# Altium schematic sheet 04 Custom.SchDoc
size A3; SheetNumber: 3; SheetTotal: 15; SPICEModelCacheQCWDKNHH: <root> / <DocumentId>QCWDKNHH</DocumentId> / <CacheFrame Number="0"> / <Model Name="pnp" Kind="MDL"> / <Text>*Default PNP BJT / *PNP Trans Pinout: C,B,E / .MODEL PNP PNP()</Text> / </Model> / </CacheFrame> / </root>
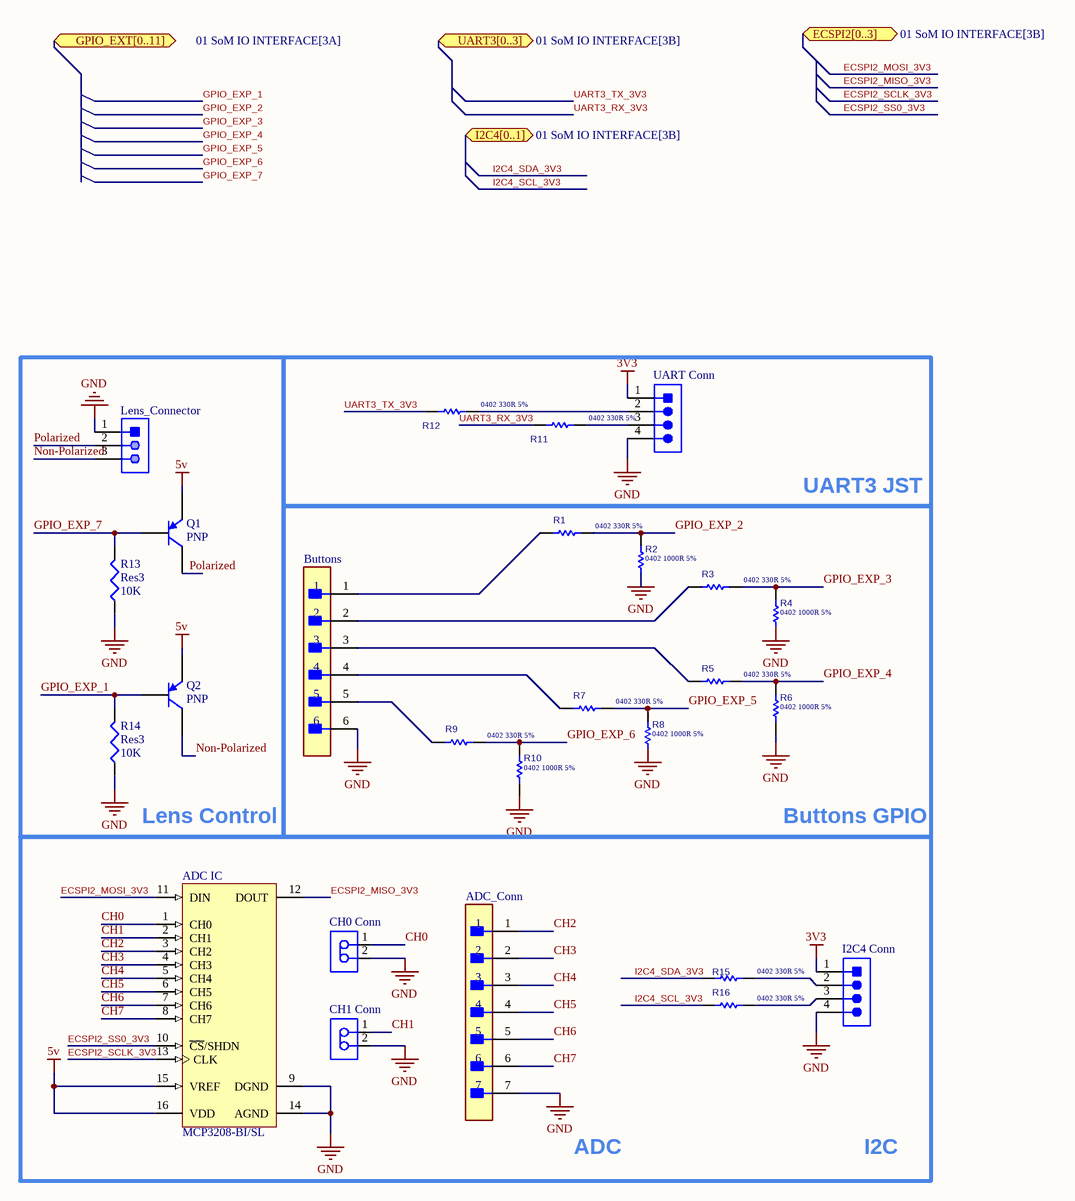
[diagram p0: 04 Custom.SchDoc]

## Parts
ADC_Conn  S7B-PH-K-S(LF)(SN)  [FP-S7B-PH-K-S_LF_SN-MFG]  (value not drawn)
ADC_IC  MCP3208-BI/SL  [SOIC-SL16_L]
Buttons  S6B-ZR(LF)(SN)  [FP-S6B-ZR_LF_SN-MFG]  (value not drawn)
CH0_Conn  B2B-PH-K-S(LF)(SN)  [JST-B2B-PH-K-S_V]  (value not drawn)
CH1_Conn  B2B-PH-K-S(LF)(SN)  [JST-B2B-PH-K-S_V]  (value not drawn)
I2C4_Conn  B4B-PH-K-S(LF)(SN)  [JST-B4B-PH-K-S_V]  (value not drawn)
Lens_Connector  B3B-PH-K-S(LF)(SN)  [JST-B3B-PH-K-S-3_V]  (value not drawn)
Q1  PNP  [SOT-23B_N]
Q2  PNP  [SOT-23B_N]
R1  0402 330R 5%  [0402_RES]
R2  0402 1000R 5%  [0402_RES]
R3  0402 330R 5%  [0402_RES]
R4  0402 1000R 5%  [0402_RES]
R5  0402 330R 5%  [0402_RES]
R6  0402 1000R 5%  [0402_RES]
R7  0402 330R 5%  [0402_RES]
R8  0402 1000R 5%  [0402_RES]
R9  0402 330R 5%  [0402_RES]
R10  0402 1000R 5%  [0402_RES]
R11  0402 330R 5%  [0402_RES]
R12  0402 330R 5%  [0402_RES]
R13  Res3  value 10K  [J1-0603]
R14  Res3  value 10K  [J1-0603]
R15  0402 330R 5%  [0402_RES]
R16  0402 330R 5%  [0402_RES]
UART_Conn  B4B-PH-K-S(LF)(SN)  [JST-B4B-PH-K-S_V]  (value not drawn)

## Blocks framed on the sheet
Lens Control: Lens_Connector Q1 Q2 R13 R14
UART3 JST: R11 R12 UART_Conn
Buttons GPIO: Buttons R1-R10

## Ports
ECSPI2[0..3] (bidir, see 01 SoM IO INTERFACE[3B]), GPIO_EXT[0..11] (bidir, see 01 SoM IO INTERFACE[3A]), I2C4[0..1] (bidir, see 01 SoM IO INTERFACE[3B]), UART3[0..3] (bidir, see 01 SoM IO INTERFACE[3B])

## Nets
3V3: I2C4_Conn.1 UART_Conn.1
5v: ADC_IC.15(VREF) ADC_IC.16(VDD) Q1.3(E) Q2.3(E)
GND: ADC_Conn.7 ADC_IC.9(DGND) ADC_IC.14(AGND) Buttons.6 CH0_Conn.2 CH1_Conn.2 I2C4_Conn.4 Lens_Connector.1 R2.1 R6.1 R10.1 R13.1 R14.1 UART_Conn.4
CH0: ADC_IC.1(CH0) CH0_Conn.1
CH1: ADC_IC.2(CH1) CH1_Conn.1
CH2: ADC_Conn.1 ADC_IC.3(CH2)
CH3: ADC_Conn.2 ADC_IC.4(CH3)
CH4: ADC_Conn.3 ADC_IC.5(CH4)
CH5: ADC_Conn.4 ADC_IC.6(CH5)
CH6: ADC_Conn.5 ADC_IC.7(CH6)
CH7: ADC_Conn.6 ADC_IC.8(CH7)
ECSPI2_MISO_3V3: ADC_IC.12(DOUT)
ECSPI2_MOSI_3V3: ADC_IC.11(DIN)
ECSPI2_SCLK_3V3: ADC_IC.13(CLK)
ECSPI2_SS0_3V3: ADC_IC.10(~{CS}/SHDN)
GPIO_EXP_1: Q2.2(B) R14.2
GPIO_EXP_2: R1.2 R2.2
GPIO_EXP_3: R3.2 R4.2
GPIO_EXP_4: R5.2 R6.2
GPIO_EXP_5: R7.2 R8.2
GPIO_EXP_6: R9.2 R10.2
GPIO_EXP_7: Q1.2(B) R13.2
I2C4_SCL_3V3: R16.1
I2C4_SDA_3V3: R15.1
Non-Polarized: Lens_Connector.3 Q2.1(C)
Polarized: Lens_Connector.2 Q1.1(C)
UART3_RX_3V3: R11.1
UART3_TX_3V3: R12.1
NetButtons_1: Buttons.1 R1.1
NetButtons_2: Buttons.2 R3.1
NetButtons_3: Buttons.3 R5.1
NetButtons_4: Buttons.4 R7.1
NetButtons_5: Buttons.5 R9.1
NetI2C4_Conn_2: I2C4_Conn.2 R15.2
NetI2C4_Conn_3: I2C4_Conn.3 R16.2
NetR11_2: R11.2 UART_Conn.3
NetR12_2: R12.2 UART_Conn.2

Not connected (* = marked no-connect by the designer): R4 1; R8 1

## Notes on the sheet
- ADC
- I2C
- Labels drawn without touching a wire or pin: GND

## Library data of the parts
ADC_Conn = CMP-17439-000222-1: CONN HEADER R/A 7POS 2MM; Number of Contacts: 7; Contact Resistance: 20mR; Gender: Male; Max Voltage Rating (AC): 100V; Max Current Rating: 2A; Insulation Resistance: 1GR; Fastening Type: Detent; Contact Shape: Square; Depth: 7.6mm; Lead Pitch: 2mm; Flammability Rating: UL94 V-0; Housing Material: Polyamide; Series: PH; Lead Free: Lead Free; Height: 9.4mm; REACH SVHC: No SVHC; Contact Type: Male Pin; Contact Finish - Mating: TIN; Contact Material: Brass; Termination: Solder; Insulation Color: Natural; Contact Mating Length: 0.13inch; Insulation Material: Nylon; Number of Positions: 7; Min Operating Temperature: -25°C; Working Voltage: 100V; Contact Plating: Tin; Length: 15.9mm; Current Rating: 2A; Voltage Rating (AC): 100V; Width: 4.5mm; Mount: Through Hole; Voltage Rating: 100V; Number of Poles: 7; Number of Rows: 1; Orientation: Right Angle; Number of Pins: 7; Pitch: 2mm; Housing Color: White; Max Operating Temperature: 85°C; Packaging: Bulk; Color: Natural; Connector Type: Header
ADC_IC = CMP-0188-00427-2: 2.7V 4-Channel/8-Channel 12-Bit A/D Converters with SPI Serial Interface, 16-Pin SOIC 150mil, B Performance Grade, Industrial Temperature; ComponentLink3URL: http://www.microchip.com/stellent/groups/techpub_sg/documents/packagingspec/en012702.pdf; PackageReference: SOIC-SL16; Code_JEDEC: MS-012-AC; ComponentLink1URL: http://www.microchip.com/; ComponentLink2Description: Datasheet; ComponentLink3Description: Package Specification; ComponentLink1Description: Manufacturer URL; DatasheetVersion: revE, Sep-2008; PackageVersion: revBB, Aug-2009; PackageDescription: 16-Lead Plastic Small Outline (SL) - Narrow, 3.90mm Body [SOIC]; RevisionNote: URLs added.; ComponentLink2URL: http://ww1.microchip.com/downloads/en/DeviceDoc/21298e.pdf; Code_IPC: SOIC127P600-16
Buttons = CMP-17439-000122-1: CONN HEADER R/A 6POS 1.5MM; Body Plating: Tin; Contact Resistance: 30mR; Voltage Rating (DC): 50V; Number of Positions: 6; Current Rating: 1A; Panel Thickness: 3.5mm; Insulation Resistance: 500MR; Gender: Male; Lead Free: Lead Free; Contact Shape: Circular; Material: Nylon; Number of Rows: 1; Fastening Type: Detent; Number of Pins: 6; Color: White; Flammability Rating: UL94 V-0; Series: ZH; Depth: 6mm; Termination: Solder; Length: 10.5mm; Lead Pitch: 1.5mm; Min Operating Temperature: -25°C; Width: 3.5mm; Max Operating Temperature: 85°C; Contact Material: Brass; Packaging: Bulk; Insulation Material: Nylon; Height: 7.2mm; Voltage Rating: 50V; Mount: Through Hole; Contact Mating Length: 0.094inch; Max Current Rating: 1A; Insulation Color: Natural; Voltage Rating (AC): 50V; Contact Type: Male Pin; Contact Finish - Mating: TIN; Pitch: 1.5mm; Number of Contacts: 6; Housing Color: Beige; REACH SVHC: No SVHC; Connector Type: Header; Orientation: Right Angle; Max Voltage Rating (AC): 50V; Housing Material: Polyamide; Contact Plating: Tin
CH0_Conn CH1_Conn = CMP-2000-05162-1: Male Header, Pitch 2 mm, 1 x 2 Position, Height 6 mm, Tail Length 3.4 mm, -25 to 85 degC, RoHS, Bulk; Manufacturer: JST; Pitch: 2mm; Style/Orientation: StraightHeader/Plug; No of Positions: 2; Datasheet Version: Nov-08; Datasheet URL: http://datasheet.octopart.com/B2B-PH-K-S%28LF%29%28SN%29-JST-datasheet-8324864.pdf; Manufacturer URL: http://www.jst.com/home2.html; Type: ShroudedHeader; Termination: Crimp
I2C4_Conn UART_Conn = CMP-2000-05165-1: Male Header, Pitch 2 mm, 1 x 4 Position, Height 6 mm, Tail Length 3.4 mm, -25 to 85 degC, RoHS, Bulk; Manufacturer: JST; No of Positions: 4; Style/Orientation: StraightHeader/Plug; Pitch: 2mm; Datasheet URL: http://datasheet.octopart.com/B4B-PH-K-S%28LF%29%28SN%29-JST-datasheet-10558886.pdf; Type: ShroudedHeader; Manufacturer URL: http://www.jst.com/home2.html; Termination: Crimp; Datasheet Version: Apr-09
Lens_Connector = CMP-2000-05164-1: Male Header, Pitch 2 mm, 1 x 3 Position, Height 6 mm, Tail Length 3.4 mm, -25 to 85 degC, RoHS, Bulk; Manufacturer: JST; Style/Orientation: StraightHeader/Plug; Pitch: 2mm; No of Positions: 3; Termination: Crimp; Manufacturer URL: http://www.jst.com/home2.html; Datasheet Version: Oct-06; Type: ShroudedHeader; Datasheet URL: https://datasheet.ciiva.com/11746/0900766b80826550-11746939.pdf
Q1 Q2 = PNP: PNP Bipolar Transistor; Published: 8-Jun-2000; LatestRevisionDate: 29-May-2009; LatestRevisionNote: IPC-7351 Footprint Added.; PackageVersion: Aug-1999; PackageReference: SOT-23B; Publisher: Altium Limited; PackageDescription: 3-Pin SOT-23 Package 0.95 mm Pitch, 2.4 mm Lead Span
R1-R12 R15 R16 = RES-CRGCQ0402J330R: 330 ±5% 0.063W, 1/16W Chip Resistor 0402 (1005 Metric) Automotive AEC-Q200, Moisture Resistant Thick Film; Manufacturer-1: TE Connectivity Passive Product; Opt. Temp.: -55°C ~ 155°C; Tolerance: %5; Manufacturer Part Number-1: CRGCQ0402J330R; Footprint: 0402; Manufacturer-2: *; Manufacturer Part Number-2: *; Inventron Stock No: *; Created By: E.E; Created Date: 23.10.2020; Checked By: *; ASSY_OPT: *; Dimensions: *; Unit Price: *; Revision Date/Note: *; Price Break: *; Class: Resistor
R13 R14 = Res3: Resistor; Published: 8-Jun-2000; LatestRevisionDate: 29-May-2009; LatestRevisionNote: IPC-7351 Footprint Added.; PackageReference: J1-0603; Publisher: Altium Limited; PackageDescription: Chip Resistor